# EAGLE design PayloadStandingV21 (EAGLE 9.0.0)
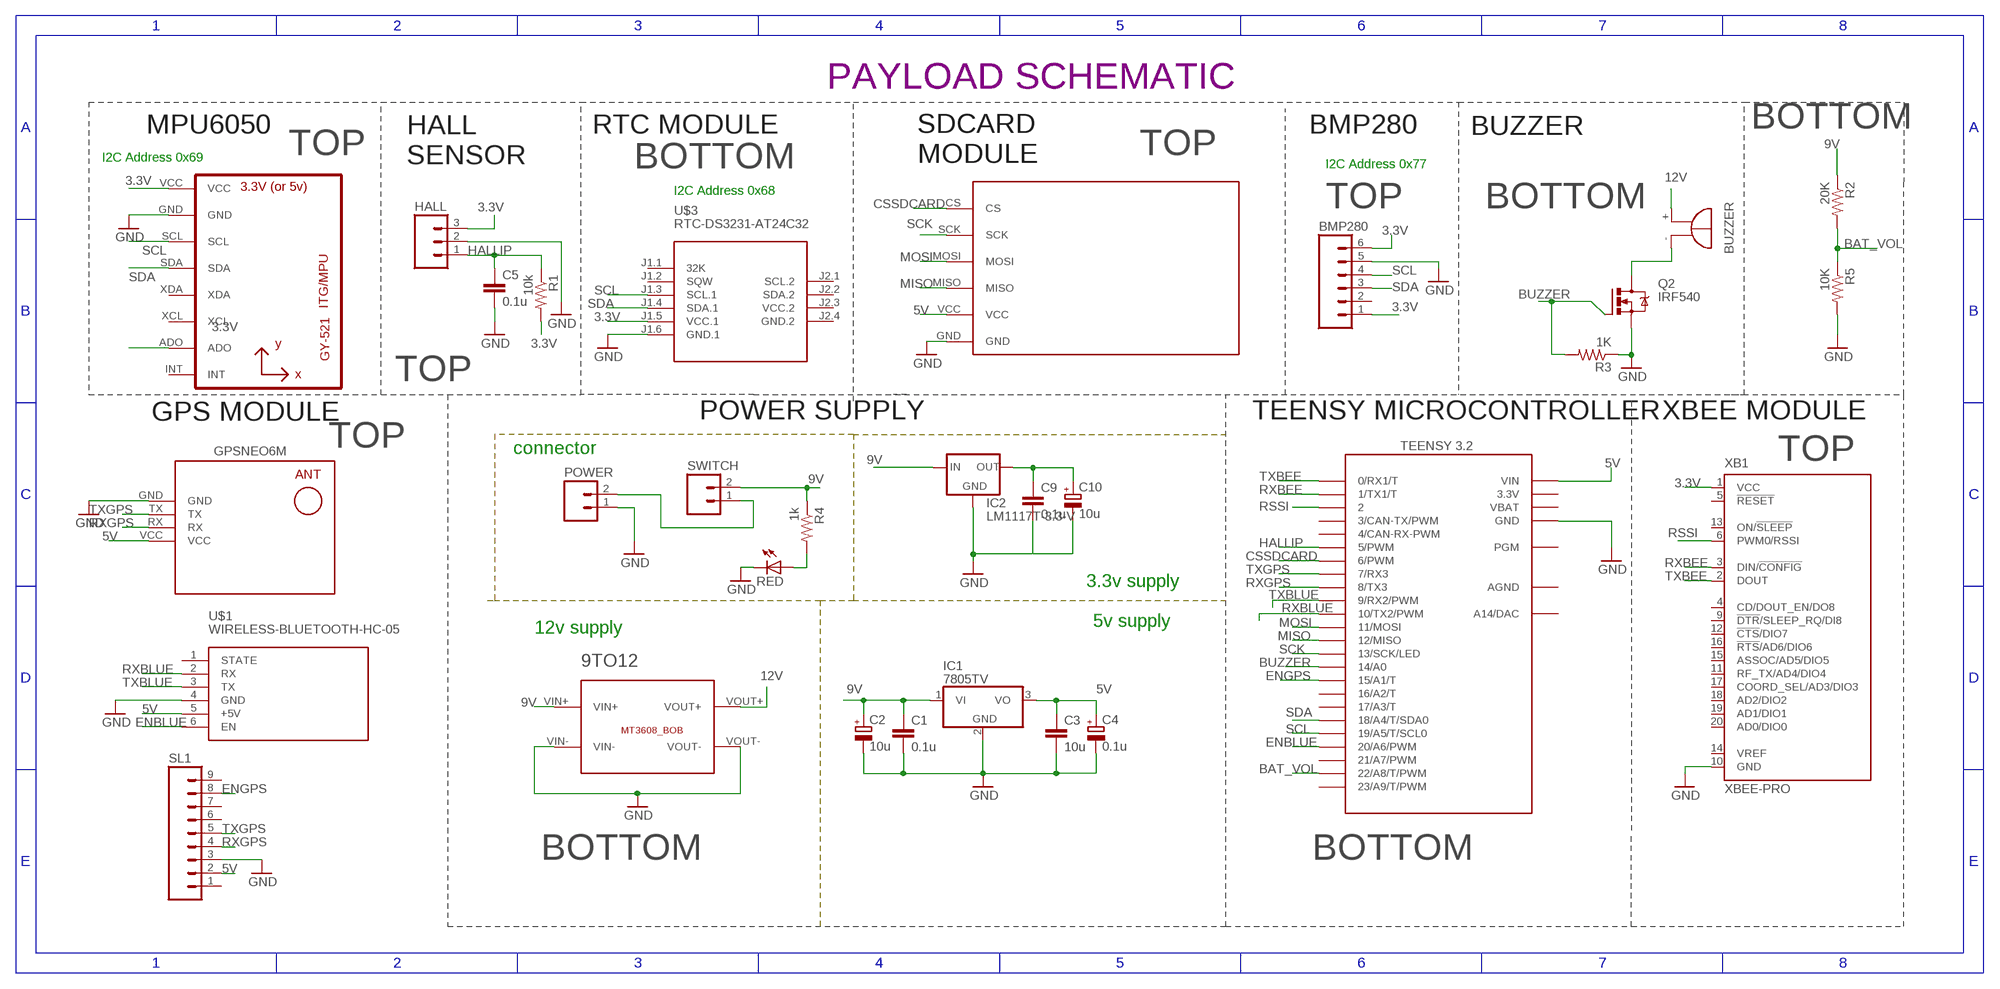
[diagram p0: schematic, sheet 1]

## Parts
9TO12  BREAKOUTS_MT3608_BOB  [BREAKOUTS_MT3608_BOB]
BMP280  M06  [06P]
C1  0.1u  C-EU025-025X050  [C025-025X050]
C2  10u  CPOL-EUE2.5-6  [E2,5-6]
C3  10u  C-EU025-025X050  [C025-025X050]
C4  0.1u  CPOL-EUE2.5-6  [E2,5-6]
C5  0.1u  C-EU025-025X050  [C025-025X050]
C9  0.1u  C-EU025-025X050  [C025-025X050]
C10  10u  CPOL-EUE2.5-6  [E2,5-6]
HALL  M03  [03P]
IC1  7805TV  [TO220V]
IC2  LM1117T-3.3-V  [TO220V]
POWER  CEDT_JANUARY_2015_V5_M02  [CEDT_JANUARY_2015_V5_02P]
Q2  IRF540  [TO220BV]
R1  10k  R-US_0204/7  [0204/7]
R2  20K  R-US_0204/7  [0204/7]
R3  1K  R-US_0204/7  [0204/7]
R4  1k  R-US_0204/7  [0204/7]
R5  10K  R-US_0204/7  [0204/7]
RED  red  LED3MM  [LED3MM]
SG1  BUZZER_EB2209A  [BUZZER_EB2209A]
SL1  M09  [09P]
SWITCH  M02  [02P]
U1  GY-521MPU6050  [GY-521]
U$1  WIRELESS-BLUETOOTH-HC-05  [WIRELESS-BLUETOOTH-HC-05]
U$2  TEENSY_3.1-3.2_OUTER_ROW  [TEENSY_3.0-3.2&LC_OUTER_ROW]
U$3  RTC-DS3231-AT24C32  [RTC-DS3231-AT24C32]
U$4  GPS-RECEIVER-NEO6M  [GPS-RECEIVER-NEO6M]
U$5  SDCARD  [M0SDCARDMODULE]
XB1  XBEE-PRO  [XBEE-PRO]

## Nets
3.3V [power]: BMP280.1 BMP280.6 C9.1 C10.+ HALL.3 IC2.2(OUT) R1.2 U1.ADO U1.VCC U$3.J1.5(VCC.1) XB1.1(VCC)
5V [power]: C3.1 C4.+ IC1.3(VO) SL1.2 U$1.5(+5V) U$2.VIN U$4.VCC U$5.VCC
9V [power]: 9TO12.VIN+ C1.1 C2.+ IC1.1(VI) IC2.3(IN) R2.1 R4.1 SWITCH.2
12V [power]: 9TO12.VOUT+ SG1.+
BAT_VOL: R2.2 R5.1 U$2.22/A8(22/A8/T/PWM)
BUZZER: Q2.G R3.2 U$2.14/A0
CSSDCARD: U$2.6(6/PWM) U$5.CS
ENBLUE: U$1.6(EN) U$2.20/A6(20/A6/PWM)
ENGPS: SL1.8 U$2.15/A1(15/A1/T)
GND [power]: 9TO12.VIN- 9TO12.VOUT- BMP280.5 C1.2 C2.- C3.2 C4.- C5.2 C9.2 C10.- HALL.2 IC1.2(GND) IC2.1(GND) POWER.1 Q2.S R3.1 R5.2 RED.K(C) SL1.3 U1.GND U$1.4(GND) U$2.GND U$2.GND1(GND) U$3.J1.6(GND.1) U$4.GND U$5.GND XB1.10(GND)
HALLIP: C5.1 HALL.1 R1.1 U$2.5(5/PWM)
MISO: U$2.12(12/MISO) U$5.MISO
MOSI: U$2.11(11/MOSI) U$5.MOSI
N$1 [power]: POWER.2 SWITCH.1
N$2: R4.2 RED.A
N$3 [power]: Q2.D SG1.-
RSSI: U$2.2 XB1.6(PWM0/RSSI)
RXBEE: U$2.1(1/TX1/T) XB1.3(DIN/!CONFIG)
RXBLUE: U$1.2(RX) U$2.10(10/TX2/PWM)
RXGPS: SL1.4 U$2.8(8/TX3) U$4.RX
SCK: U$2.13(13/SCK/LED) U$5.SCK
SCL: BMP280.4 U1.SCL U$2.19/A5(19/A5/T/SCL0) U$3.J1.3(SCL.1)
SDA: BMP280.3 U1.SDA U$2.18/A4(18/A4/T/SDA0) U$3.J1.4(SDA.1)
TXBEE: U$2.0(0/RX1/T) XB1.2(DOUT)
TXBLUE: U$1.3(TX) U$2.9(9/RX2/PWM)
TXGPS: SL1.5 U$2.7(7/RX3) U$4.TX
Unconnected: BMP280.2 SL1.1 SL1.6 SL1.7 SL1.9 U1.INT U1.XCL U1.XDA U$1.1(STATE) U$2.3(3/CAN-TX/PWM) U$2.4(4/CAN-RX-PWM) U$2.16/A2(16/A2/T) U$2.17/A3(17/A3/T) U$2.21/A7(21/A7/PWM) U$2.23/A9(23/A9/T/PWM) U$2.PGM U$2.RESET/DAC(A14/DAC) U$3.J1.1(32K) U$3.J1.2(SQW) U$3.J2.1(SCL.2) U$3.J2.2(SDA.2) XB1.4(CD/DOUT_EN/DO8) XB1.5(!RESET) XB1.9(!DTR!/SLEEP_RQ/DI8) XB1.11(RF_TX/AD4/DIO4) XB1.12(!CTS!/DIO7) XB1.13(ON/!SLEEP) XB1.14(VREF) XB1.15(ASSOC/AD5/DIO5) XB1.16(!RTS!/AD6/DIO6) XB1.17(COORD_SEL/AD3/DIO3) XB1.18(AD2/DIO2) XB1.19(AD1/DIO1) XB1.20(AD0/DIO0)

## Notes on the sheet
- PAYLOAD SCHEMATIC
- MPU6050 | RTC MODULE | BMP280 | BUZZER | BOTTOM
- TOP | TOP
- I2C Address 0x69
- SDCARD
  MODULE
- HALL
  SENSOR
- BOTTOM | I2C Address 0x77
- I2C Address 0x68
- TOP | BOTTOM
- TOP
- GPS MODULE | POWER SUPPLY | TEENSY MICROCONTROLLER | XBEE MODULE
- TOP
- connector
- TOP
- 3.3v supply
- 5v supply
- 12v supply
- BOTTOM | BOTTOM

## Power pins joined to a net without a drawn wire
3.3V: U$2.3.3V U$2.3.3V1(3.3V)
AGND: U$2.AGND
GND.2: U$3.J2.4(GND.2)
VBAT: U$2.VBAT
VCC.2: U$3.J2.3(VCC.2)

## Library data of the parts
9TO12 = Cansat2019_3279_Container_v01:BREAKOUTS_MT3608_BOB
BMP280 = con-amp-quick:M06: AMP QUICK CONNECTOR; OC_FARNELL: unknown; OC_NEWARK: unknown
C1 C3 C5 C9 = resistor:C-EU: CAPACITOR, European symbol
C2 C4 C10 = rcl:CPOL-EU: POLARIZED CAPACITOR, European symbol; SPICEPREFIX: C
HALL = con-amp-quick:M03: AMP QUICK CONNECTOR; OC_FARNELL: unknown; OC_NEWARK: unknown
IC1 = linear:78*: Positive VOLTAGE REGULATOR Source: http://cache.national.com/ds/LM/LM78L05.pdf http://www.fairchildsemi.com/ds/LM/LM7805.pdf
IC2 = lm1117:LM1117T-*
POWER = Cansat2019_3279_Container_v01:CEDT_JANUARY_2015_V5_M02: AMP QUICK CONNECTOR
Q2 = transistor-power:IRF540: HEXFET Power MOSFET
R1-R5 = rcl:R-US_: RESISTOR, American symbol; SPICEPREFIX: R
RED = CEDT_JANUARY_2015_v5:LED
SG1 = Cansat2019_3279_Container_v01:BUZZER_EB2209A: BUZZER Source: Buerklin; OC_FARNELL: unknown; OC_NEWARK: unknown
SL1 = con-amp-quick:M09: AMP QUICK CONNECTOR; OC_FARNELL: unknown; OC_NEWARK: unknown
SWITCH = CEDT_JANUARY_2015_v5:M02: AMP QUICK CONNECTOR
U1 = gy-521:GY-521
U$1 = diy-modules(1):WIRELESS-BLUETOOTH-HC-05: Bluetooth Transceiver Module based on HC-05 board Tutorial is available here: https://arduino-info.wikispaces.com/BlueTooth-HC05-HC06-Modules-How-To Click here to find device on ebay.com <http://www.ebay.com/sch/hc-05+module+rs232>
U$2 = Teensy_3_and_LC_Series_Boards_v1.4:TEENSY_3.1-3.2_OUTER_ROW: Footprint for Teensy 3.1 or 3.2 board using all pin connections on the outer perimeter
U$3 = diy-modules:RTC-DS3231-AT24C32: RTC Module with Battery and EEPROM based on DS3231 and AT24C32 chips Tutorial can be found here: https://edwardmallon.wordpress.com/2014/05/21/using-a-cheap-3-ds3231-rtc-at24c32-eeprom-from-ebay/ Click here to find device on ebay.com <http://www.ebay.com/sch/DS3231+AT24C32+module>
U$4 = diy-modules:GPS-RECEIVER-NEO6M: GPS Receiver Module based on NEO-6 device Short tutorial how to use NEO-6 module with Arduino: http://www.xarg.org/2016/06/neo6mv2-gps-module-with-arduino/ NEO-6 datasheet is available here: https://www.u-blox.com/sites/default/files/products/documents/NEO-6_DataSheet_%28GPS.G6-HW-09005%29.pdf Click here to find device on ebay.com <http://www.ebay.com/sch/gyneo6mv2>
U$5 = mylib:SDCARD
XB1 = maxstream:XBEE: XBee (TM) /XBee-PRO(TM) OEM RF Modules Source: MaxStream, Inc. xbee_productmanual.pdf; MPN: XBP24-AWI-001; OC_FARNELL: 1337916; OC_NEWARK: 42M2667

## Net classes
0 default: width 0.508 mm
1 power: width 0.61 mm

## Board
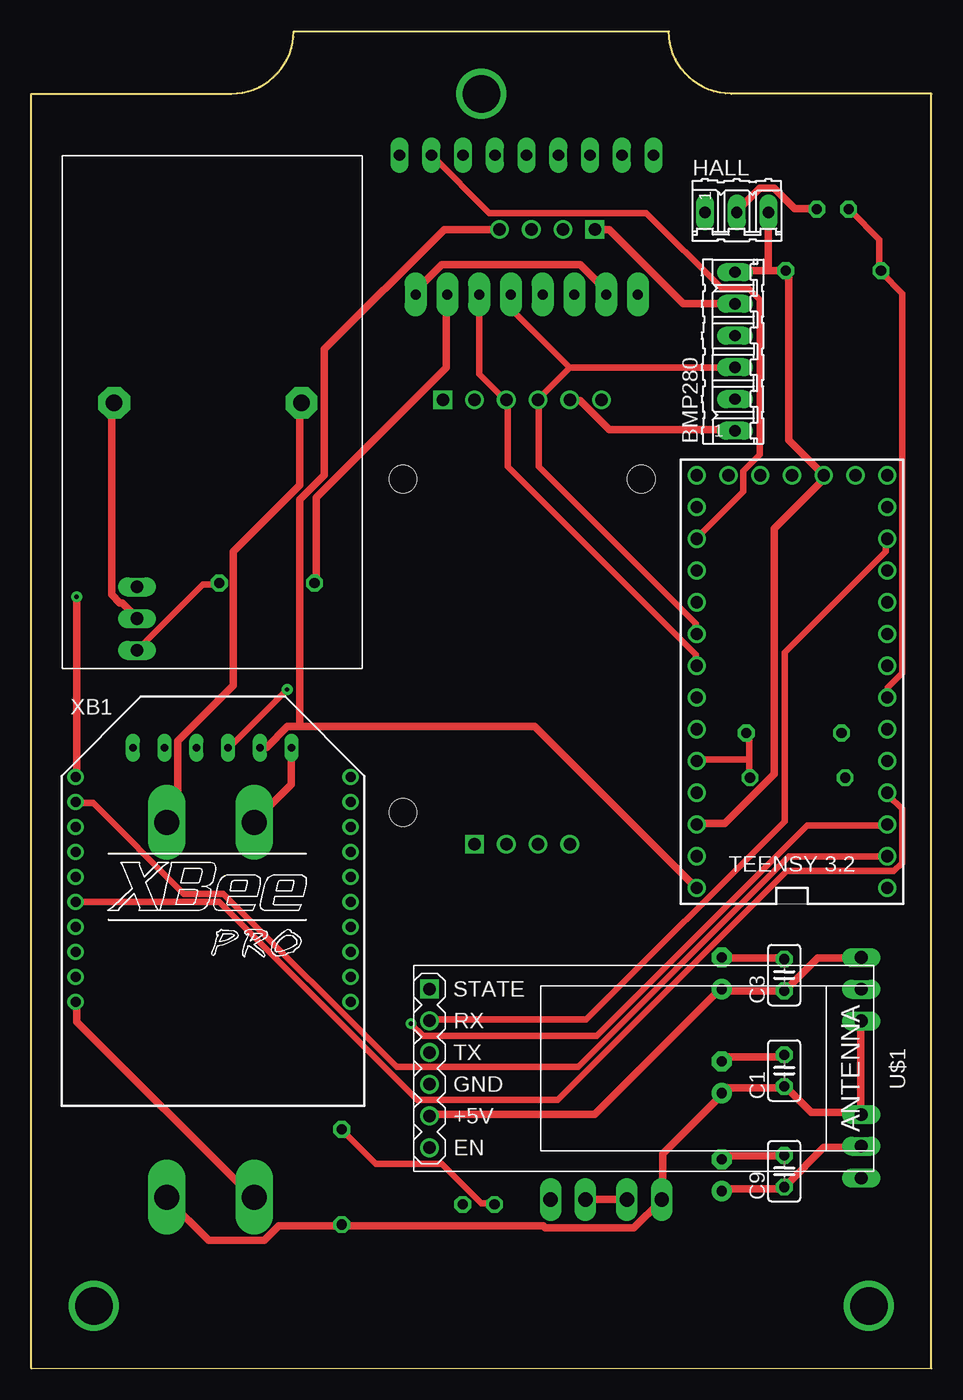
[diagram p1: board, top side]
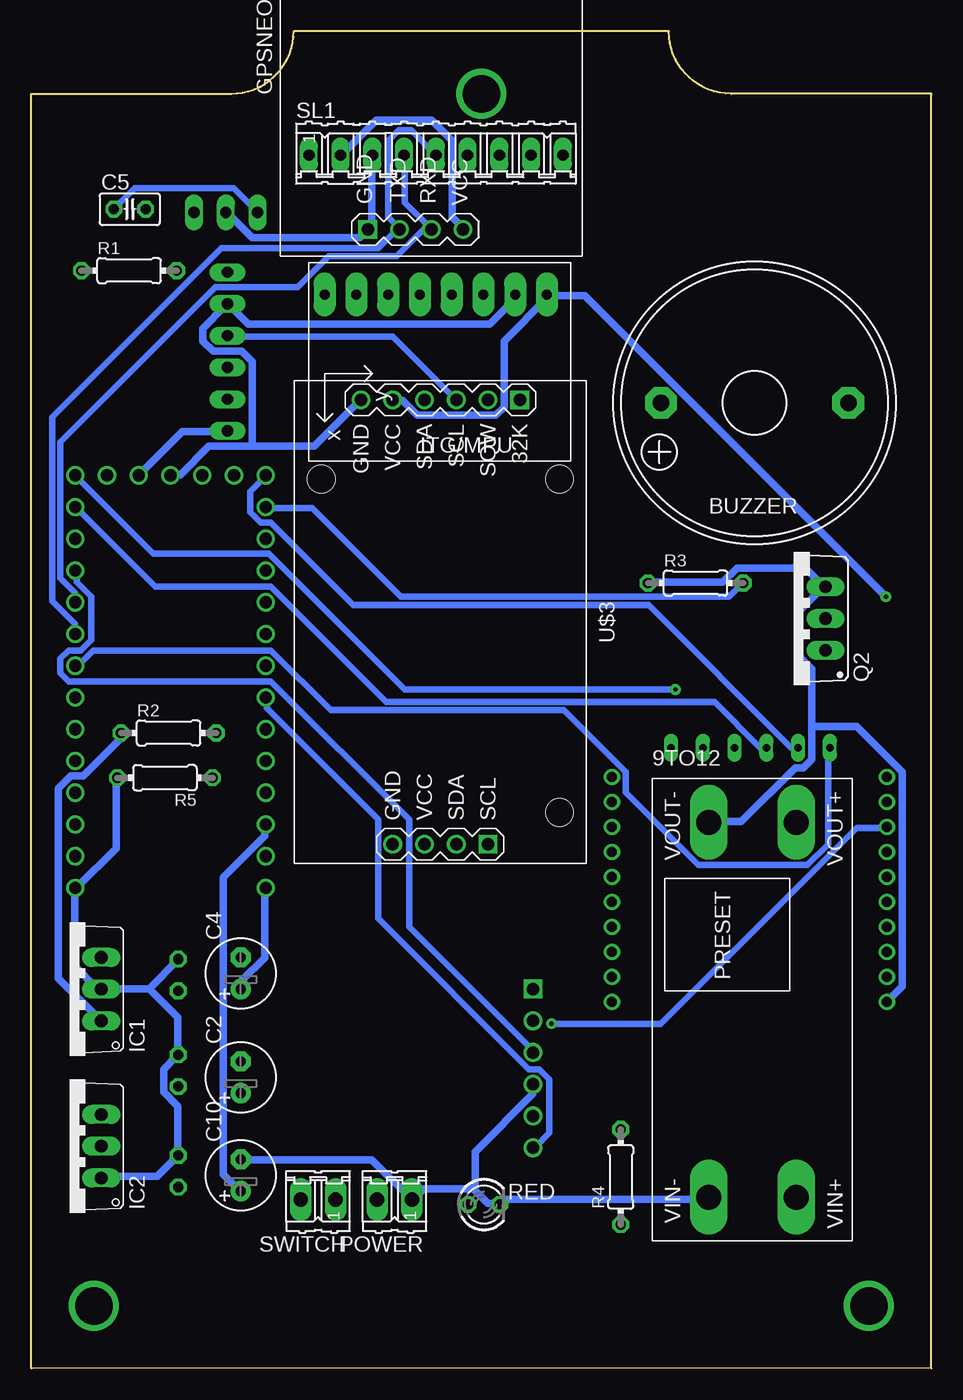
[diagram p2: board, bottom side, seen from below]

Size 72 x 107 mm. Coordinates in mm from the lower left corner, seen from the top.
Outline: 0,0 72,0 72,102 56,102 arc-90 51,107 21,107 arc-90 16,102 0,102 0,0
Copper layers (1*16): Top 0.035mm / dielectric 1.5mm / Bottom 0.035mm
Design rules "default *": minimum track width 6mil, minimum drill 0.35mm, track to track 6mil, track to pad 6mil, pad to pad 6mil, via to via 6mil, smd to smd 6mil, copper to edge 40mil, drill to drill 6mil, minimum pad ring 10mil, minimum via ring 10mil, stop-mask expansion 4mil, vias tented up to drill 0mil, thermal gap 10mil

### Footprints (pad centres in the part's own frame; a part is rotated, then mirrored left to right if it is on the bottom)
BREAKOUTS_MT3608_BOB = drill 2 pad 3 long: VIN+ 33.5,-4.5; VIN- 33.5,-11.5; VOUT+ 3.5,-4.5; VOUT- 3.5,-11.5
06P = drill 0.914 long: 1 -6.35,0; 2 -3.81,0; 3 -1.27,0; 4 1.27,0; 5 3.81,0; 6 6.35,0
C025-025X050 = drill 0.813 octagon: 1 -1.27,0; 2 1.27,0
E2,5-6 = drill 0.813 pad 1.6: + -1.27,0 | drill 0.813 pad 1.6 octagon: - 1.27,0
03P = drill 0.914 long: 1 -2.54,0; 2 0,0; 3 2.54,0
TO220V = drill 1.016 long: 1 -2.54,-2.54; 2 0,-2.54; 3 2.54,-2.54
CEDT_JANUARY_2015_V5_02P = drill 1.143 long: 1 -1.397,0; 2 1.397,0
TO220BV = drill 1.016 long: D 0,-2.54; G -2.54,-2.54; S 2.54,-2.54
0204/7 = drill 0.813 octagon: 1 -3.81,0; 2 3.81,0
LED3MM = drill 0.813 octagon: A -1.27,0; K 1.27,0
BUZZER_EB2209A = drill 1.321 pad 2.54 octagon: + 7.493,0; - -7.493,0
09P = drill 0.914 long: 1 -10.16,0; 2 -7.62,0; 3 -5.08,0; 4 -2.54,0; 5 0,0; 6 2.54,0; 7 5.08,0; 8 7.62,0; 9 10.16,0
02P = drill 1.143 long: 1 -1.397,0; 2 1.397,0
GY-521 = drill 0.8 pad 1.778 long: ADO -8.89,-6.35; GND -8.89,6.35; INT -8.89,-8.89; SCL -8.89,3.81; SDA -8.89,1.27; VCC -8.89,8.89; XCL -8.89,-3.81; XDA -8.89,-1.27
WIRELESS-BLUETOOTH-HC-05 = drill 1 square: 1 -6.35,-17.145 | drill 1: 2 -3.81,-17.145; 3 -1.27,-17.145; 4 1.27,-17.145; 5 3.81,-17.145; 6 6.35,-17.145
TEENSY_3.0-3.2&LC_OUTER_ROW = drill 0.965: 0 -7.62,13.97; 1 -7.62,11.43; 2 -7.62,8.89; 3 -7.62,6.35; 3.3V 7.62,11.43; 3.3V1 -2.54,-16.51; 4 -7.62,3.81; 5 -7.62,1.27; 6 -7.62,-1.27; 7 -7.62,-3.81; 8 -7.62,-6.35; 9 -7.62,-8.89; 10 -7.62,-11.43; 11 -7.62,-13.97; 12 -7.62,-16.51; 13 7.62,-16.51; 14/A0 7.62,-13.97; 15/A1 7.62,-11.43; 16/A2 7.62,-8.89; 17/A3 7.62,-6.35; 18/A4 7.62,-3.81; 19/A5 7.62,-1.27; 20/A6 7.62,1.27; 21/A7 7.62,3.81; 22/A8 7.62,6.35; 23/A9 7.62,8.89; AGND 7.62,13.97; GND -7.62,16.51; GND1 0,-16.51; PGM 2.54,-16.51; RESET/DAC 5.08,-16.51; VBAT -5.08,-16.51; VIN 7.62,16.51
RTC-DS3231-AT24C32 = drill 1 square: J1.1 -17.78,6.35; J2.1 17.78,3.81 | drill 1: J1.2 -17.78,3.81; J1.3 -17.78,1.27; J1.4 -17.78,-1.27; J1.5 -17.78,-3.81; J1.6 -17.78,-6.35; J2.2 17.78,1.27; J2.3 17.78,-1.27; J2.4 17.78,-3.81 | hole 2.2: -11.43,-9.525; -11.43,9.525; 15.24,9.525
GPS-RECEIVER-NEO6M = drill 1 square: GND -15.875,5.08 | drill 1: RX -15.875,0; TX -15.875,2.54; VCC -15.875,-2.54
M0SDCARDMODULE = drill 0.6 long: CS -6.35,6.35; GND -6.35,-6.35; MISO -6.35,-1.27; MOSI -6.35,1.27; SCK -6.35,3.81; VCC -6.35,-3.81
XBEE-PRO = drill 0.8 pad 1.27: 1 -11,9; 2 -11,7; 3 -11,5; 4 -11,3; 5 -11,1; 6 -11,-1; 7 -11,-3; 8 -11,-5; 9 -11,-7; 10 -11,-9; 11 11,-9; 12 11,-7; 13 11,-5; 14 11,-3; 15 11,-1; 16 11,1; 17 11,3; 18 11,5; 19 11,7; 20 11,9

### Placement (x,y rotation side)
9TO12  6.32,47.2 270 bottom
BMP280  56.29,81.37 90 top
C1  60.24,23.82 90 top
C2  55.24,23.29 90 bottom
C3  60.24,31.47 90 top
C4  55.24,31.61 90 bottom
C5  64.12,92.76 0 bottom
C9  60.24,15.77 90 top
C10  55.24,15.45 90 bottom
HALL  56.44,92.49 0 top
IC1  68.94,30.34 90 bottom
IC2  68.94,17.77 90 bottom
POWER  42.94,13.51 180 bottom
Q2  11,60 90 bottom
R1  64.17,87.84 0 bottom
R2  61.01,50.84 0 bottom
R3  18.85,62.84 0 bottom
R4  24.84,15.31 90 bottom
R5  61.3,47.26 180 bottom
RED  35.79,13.11 0 bottom
SG1  14.13,77.26 180 bottom
SL1  39.62,97.08 0 bottom
SWITCH  49.05,13.51 180 bottom
U1  39.63,77.05 270 bottom
U$1  49,24 270 top
U$2  60.86,54.95 180 top
U$3  39.27,59.72 270 bottom
U$4  40,107.02 90 bottom
U$5  14.47,56.02 90 top
XB1  14.55,38.32 0 top

### Tracks (layer width: path | path; a pad name or v marks a point on that pad's centre or on a via)
3.3V  (via drill 0.35)
  Top 0.61: C10.+ 55.31,14.2 55.47,14.36 60.1,14.36 C9.1 60.43,14.69 63.4,17.67 66.37,17.67 IC2.2 | 58.94,87.83 56.3,87.83 BMP280.6 | 58.94,87.83 60.26,87.83 R1.2 60.59,87.67 60.59,74.3 63.4,71.49 U$2.3.3V1 63.4,71.16 59.44,67.2 59.44,47.55 55.47,43.59 53.33,43.59 U$2.3.3V | 58.94,87.83 58.94,92.46 HALL.3 | U$3.J1.5 43.09,77.43 43.92,77.43 46.23,75.12 56.13,75.12 BMP280.1 | v3.63,61.75 3.63,47.38 XB1.1 | U1.ADO 45.9,86.02 45.9,86.35 43.92,88.33 32.85,88.33 30.87,86.35 30.87,86.02 U1.VCC
  Bottom 0.61: U$2.3.3V 53.33,43.42 53.33,42.6 56.63,39.29 56.63,15.52 55.31,14.2 C10.+ | BMP280.1 56.3,74.95 59.93,74.95 63.4,71.49 U$2.3.3V1 | v3.63,61.75 27.74,85.85 30.71,85.85 U1.VCC 30.71,85.69 34.18,82.22 34.18,76.94 34.84,76.28 41.11,76.28 42.27,77.43 42.93,77.43 U$3.J1.5
5V
  Top 0.61: U$1.5 31.86,20.31 45.07,20.31 54.98,30.21 C4.+ 55.31,30.21 60.1,30.21 C3.1 60.43,30.38 62.9,32.85 66.37,32.85 IC1.3 | 21.46,51.35 40.28,51.35 53.16,38.47 U$2.VIN | 21.46,51.35 20.47,51.35 18.82,49.7 18.33,49.7 U$5.VCC | 21.46,51.35 21.46,69.51 23.44,71.49 23.44,81.56 33.02,91.14 37.31,91.14 U$4.VCC
  Bottom 0.61: SL1.2 47.22,97.08 44.41,99.89 39.95,99.89 38.3,98.23 38.3,92.13 37.48,91.3 U$4.VCC | C4.+ 55.14,30.38 55.14,31.04 53.33,32.85 53.33,38.3 U$2.VIN
9V
  Top 0.61: 9TO12.VIN+ 10.9,13.54 14.2,10.24 18.66,10.24 19.81,11.39 24.77,11.39 R4.1 25.09,11.39 40.95,11.39 41.11,11.23 48.21,11.23 50.35,13.37 SWITCH.2 50.52,13.54 50.52,17.17 55.14,21.79 C2.+ 55.31,22.12 55.64,22.45 60.1,22.45 C1.1 60.43,22.45 62.41,20.47 66.37,20.47 IC2.3 66.37,20.64 66.37,27.74 IC1.1
  Bottom 0.61: R2.1 64.88,50.69 64.88,50.35 67.86,47.38 68.85,47.38 69.84,46.39 69.84,31.2 66.53,27.9 IC1.1
12V
  Top 0.61: SG1.+ 21.46,77.1 21.46,70.66 16.18,65.38 16.18,54.65 11.72,50.19 11.72,44.58 10.9,43.75 9TO12.VOUT+
BAT_VOL
  Top 0.508: 57.45,48.7 57.45,50.52 57.29,50.69 R2.2 | 57.45,48.7 57.45,47.38 R5.1 | 57.45,48.7 53.33,48.7 U$2.22/A8
BUZZER
  Top 0.508: R3.2 15.02,62.74 13.7,62.74 8.59,57.62 Q2.G
  Bottom 0.508: U$2.14/A0 53.16,68.85 49.53,68.85 42.43,61.75 16.18,61.75 15.19,62.74 R3.2
CSSDCARD
  Bottom 0.508: U$5.CS 8.26,49.53 8.26,41.94 9.91,40.28 18.66,40.28 24.43,46.06 24.43,47.71 29.39,52.67 48.04,52.67 52.83,57.45 67.03,57.45 68.35,56.13 U$2.6
ENBLUE
  Bottom 0.508: U$2.20/A6 53.16,53.66 53.16,52.83 44.25,43.92 44.25,35.99 32.19,23.94 31.37,23.94 30.54,23.11 30.54,18.82 31.7,17.67 U$1.6
ENGPS
  Top 0.508: SL1.8 32.03,97.08 36.65,92.46 49.2,92.46 55.31,86.35 57.45,86.35 58.28,85.52 58.28,73.14 56.96,71.82 56.96,70.17 53.33,66.53 U$2.15/A1
GND
  Top 0.61: C5.2 62.74,92.79 61.09,92.79 59.44,94.44 58.28,94.44 56.46,92.62 HALL.2 | BMP280.5 56.13,85.19 52.17,85.19 46.23,91.14 45.24,91.14 U$4.GND | U$5.GND 20.8,49.53 20.8,46.72 17.83,43.75 9TO12.VOUT- | XB1.10 3.63,29.22 3.63,27.74 17.67,13.7 9TO12.VIN- | C9.2 60.1,17 55.47,17 55.31,16.84 C10.- | C1.2 60.1,24.93 55.64,24.93 55.31,24.6 C2.- | C3.2 60.1,32.85 55.31,32.85 C4.- | U1.GND 33.19,85.85 33.19,80.07 22.78,69.67 22.78,62.9 R3.1
  Bottom 0.61: 54.32,73.8 49.37,73.8 45.73,77.43 U$3.J1.6 | 54.32,73.8 57.78,73.8 60.1,71.49 60.76,71.49 U$2.GND1 | SL1.3 44.74,97.08 44.74,91.63 45.07,91.3 U$4.GND 45.24,90.97 45.73,90.47 54.32,90.47 56.3,92.46 HALL.2 | U1.GND 33.35,85.85 33.35,85.52 35.33,83.54 54.65,83.54 56.13,85.03 BMP280.5 56.46,85.03 58.28,83.21 58.28,82.22 57.45,81.39 55.14,81.39 54.32,80.57 54.32,73.8 | R3.1 22.62,62.9 16.68,62.9 15.52,64.06 10.07,64.06 8.59,62.57 Q2.S 8.75,62.41 10.57,60.59 10.57,56.96 9.58,55.97 9.58,51.35 | 9.58,51.35 9.58,48.7 10.24,48.04 10.9,48.04 15.19,43.75 17.67,43.75 9TO12.VOUT- | 36.65,14.36 35.5,13.21 34.67,13.21 RED.K 34.34,13.21 34.01,13.54 17.83,13.54 9TO12.VIN- | 36.65,14.36 40.62,14.36 41.44,13.54 POWER.1 41.77,13.7 44.74,16.68 55.14,16.68 C10.- | U$1.4 31.86,22.62 31.86,21.96 36.49,17.34 36.49,14.53 36.65,14.36 | IC2.1 66.37,15.35 61.91,15.35 60.26,17 C9.2 60.26,17.34 60.26,20.97 61.42,22.12 61.42,23.94 60.43,24.93 C1.2 60.26,25.09 60.26,28.07 62.57,30.38 | R5.2 65.22,47.22 65.22,41.6 68.35,38.47 U$2.GND 68.52,38.14 68.52,32.19 66.7,30.38 IC1.2 66.37,30.38 62.57,30.38 | 62.57,30.38 60.26,32.69 C3.2 | 9.58,51.35 5.94,51.35 2.31,47.71 2.31,30.54 3.47,29.39 XB1.10
HALLIP
  Top 0.508: C5.1 65.55,92.62 67.86,90.31 67.86,88 R1.1 68.02,87.67 69.67,86.02 69.67,55.64 68.52,54.48 68.52,53.82 U$2.5
  Bottom 0.508: HALL.1 53.99,92.62 55.8,94.44 63.73,94.44 65.38,92.79 C5.1
MISO  (via drill 0.35)
  Top 0.508: v20.47,54.32 15.85,49.7 U$5.MISO
  Bottom 0.508: v20.47,54.32 42.1,54.32 53,65.22 62.24,65.22 68.35,71.32 U$2.12
MOSI
  Bottom 0.508: U$5.MOSI 13.21,49.7 13.7,49.7 17.34,53.33 43.59,53.33 52.83,62.57 62.08,62.57 68.35,68.85 U$2.11
N$1
  Top 0.61: POWER.2 44.41,13.54 47.55,13.54 SWITCH.1
N$2
  Top 0.508: RED.A 36.98,13.21 35.99,13.21 32.85,16.34 27.57,16.34 24.93,18.99 R4.2
N$3
  Top 0.61: Q2.D 8.42,60.1 7.26,61.25 7.1,61.25 6.44,61.91 6.44,76.94 6.6,77.1 SG1.-
N$4  (via drill 3)
  other vias: 67,5
N$5  (via drill 3)
  other vias: 5,5
N$6  (via drill 3)
  other vias: 36,102
RSSI
  Top 0.508: XB1.6 3.63,37.31 15.02,37.31 30.87,21.46 42.1,21.46 60.43,39.79 69.01,39.79 69.67,40.45 69.67,44.74 68.52,45.9 U$2.2
RXBEE  (via drill 0.35)
  Top 0.508: v30.38,27.57 31.37,26.58 45.24,26.58 62.08,43.42 68.35,43.42 U$2.1
  Bottom 0.508: v30.38,27.57 21.63,27.57 5.94,43.26 3.63,43.26 XB1.3
RXBLUE
  Top 0.508: U$2.10 68.35,66.37 68.35,65.38 60.26,57.29 60.26,43.75 44.41,27.9 31.86,27.9 U$1.2
RXGPS
  Bottom 0.508: SL1.4 42.1,97.08 42.1,93.28 40.12,91.3 U$4.RX 40.45,91.3 42.76,88.99 48.21,88.99 50.69,86.51 57.29,86.51 69.67,74.13 69.67,63.23 68.52,62.08 68.52,61.42 U$2.8
SCK
  Bottom 0.508: U$5.SCK 10.73,49.7 11.23,49.7 22.62,61.09 46.23,61.09 52.83,67.69 53.66,67.69 54.48,68.52 54.48,70.17 53.33,71.32 U$2.13
SCL
  Top 0.508: U$2.19/A5 53.16,56.3 53.16,57.12 38.14,72.15 38.14,77.43 U$3.J1.3 37.81,77.6 35.83,79.58 35.83,85.85 U1.SCL
  Bottom 0.508: BMP280.4 56.13,82.55 43.09,82.55 38.14,77.6 U$3.J1.3
SDA
  Top 0.508: 43.09,80.07 56.13,80.07 BMP280.3 | 43.09,80.07 40.62,77.6 U$3.J1.4 40.62,77.27 40.62,72.15 53.16,59.6 53.16,58.78 U$2.18/A4 | 43.09,80.07 38.47,84.7 38.47,85.85 U1.SDA
TXBEE
  Top 0.508: XB1.2 3.63,45.24 4.95,45.24 12.22,37.97 15.35,37.97 29.22,24.11 43.75,24.11 60.59,40.95 68.35,40.95 U$2.0
TXBLUE
  Bottom 0.508: U$2.9 68.35,63.73 68.35,62.9 67.2,61.75 67.2,58.28 68.02,57.45 69.01,57.45 69.67,56.79 69.67,55.64 69.01,54.98 52.83,54.98 41.77,43.92 41.77,35.33 31.86,25.43 U$1.3
TXGPS
  Bottom 0.508: SL1.5 41.6,99.06 42.6,99.06 43.42,98.23 43.42,92.13 42.6,91.3 U$4.TX 42.76,91.14 44.25,89.65 56.79,89.65 70.33,76.11 70.33,61.42 68.52,59.6 68.52,58.78 U$2.7